# EAGLE design HS-736USB (EAGLE 7.1.0)
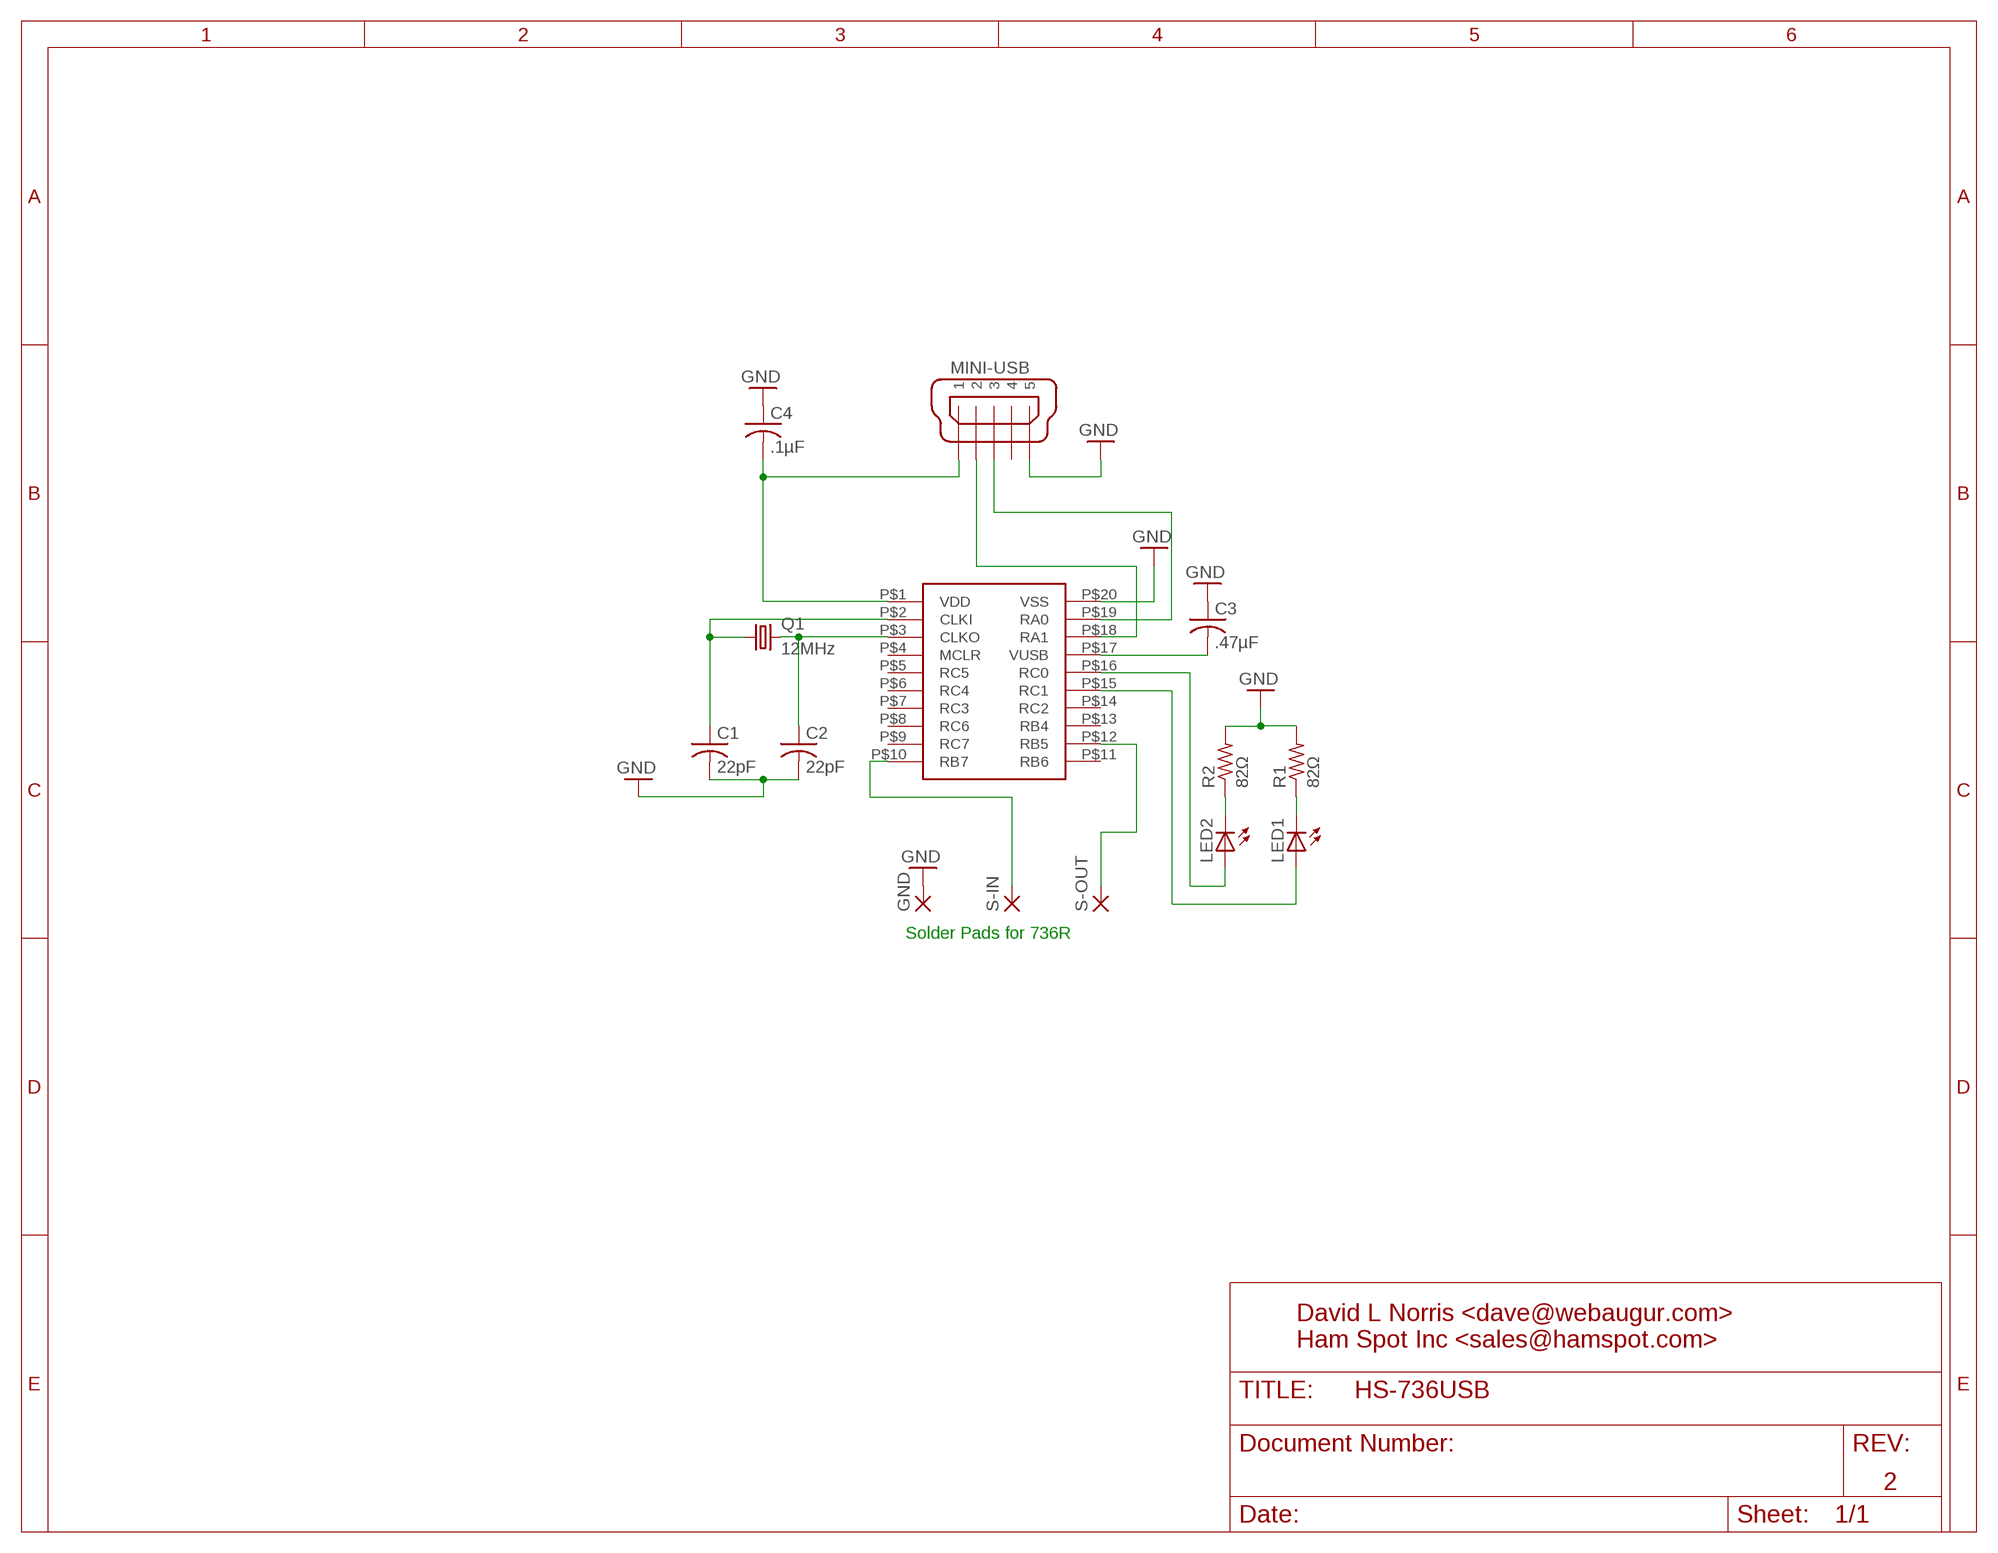
[diagram p0: schematic, sheet 1]

## Parts
C1  22pF  C-USC1206  [C1206]
C2  22pF  C-USC1206  [C1206]
C3  .47µF  C-USC1206  [C1206]
C4  .1µF  C-USC1206  [C1206]
GND  3,17/1,3  [3,17/1,3]
LED1  LED5MM  [LED5MM]
LED2  LED5MM  [LED5MM]
MINI-USB  MINI-USB-UX60-MB-5ST  [UX60-MB-5ST]
Q1  12MHz  CRYSTALHC49S  [HC49/S]
R1  82Ω  R-US_0204/2V  [0204V]
R2  82Ω  R-US_0204/2V  [0204V]
S-IN  3,17/1,3  [3,17/1,3]
S-OUT  3,17/1,3  [3,17/1,3]
U$1  14K50_DIP  [14K50_DIP]

## Nets
GND: C1.2 C2.2 C3.1 C4.1 GND.1(P) MINI-USB.5 R1.2 R2.2 U$1.P$20(VSS)
N$1: C2.1 Q1.2 U$1.P$3(CLKO)
N$2: C1.1 Q1.1 U$1.P$2(CLKI)
N$3: LED2.K(C) R2.1
N$4: C4.2 MINI-USB.1 U$1.P$1(VDD)
N$5: LED1.K(C) R1.1
N$6: C3.2 U$1.P$17(VUSB)
N$7: MINI-USB.2 U$1.P$18(RA1)
N$8: MINI-USB.3 U$1.P$19(RA0)
N$9: S-OUT.1(P) U$1.P$12(RB5)
N$10: S-IN.1(P) U$1.P$10(RB7)
N$11: LED2.A U$1.P$16(RC0)
N$12: LED1.A U$1.P$15(RC1)
Unconnected: MINI-USB.4 U$1.P$4(MCLR) U$1.P$5(RC5) U$1.P$6(RC4) U$1.P$7(RC3) U$1.P$8(RC6) U$1.P$9(RC7) U$1.P$11(RB6) U$1.P$13(RB4) U$1.P$14(RC2)

## Notes on the sheet
- Solder Pads for 736R
- David L Norris <dave@webaugur.com>
  Ham Spot Inc <sales@hamspot.com>
- 2

## Library data of the parts
C1-C4 = rcl:C-US: CAPACITOR, American symbol
GND S-IN S-OUT = wirepad:3,17/1,3: THROUGH-HOLE PAD
LED1 LED2 = led:LED: LED OSRAM: - CHIPLED LG R971, LG N971, LY N971, LG Q971, LY Q971, LO R971, LY R971 LH N974, LH R974 LS Q976, LO Q976, LY Q976 LO Q996 - Hyper CHIPLED LW Q18S LB Q993, LB Q99A, LB R99A - SideLED LS A670, LO A670, LY A670, LG A670, LP A670 LB A673, LV A673, LT A673, LW A673 LH A674 LY A675 LS A676, LA A676, LO A676, LY A676, LW A676 LS A679, LY A679, LG A679 - Hyper Micro SIDELED® LS Y876, LA Y876, LO Y876, LY Y876 LT Y87S - SmartLED LW L88C, LW L88S LB L89C, LB L89S, LG L890 LS L89K, LO L89K, LY L89K LS L896, LA L896, LO L896, LY L896 - TOPLED LS T670, LO T670, LY T670, LG T670, LP T670 LSG T670, LSP T670, LSY T670, LOP T670, LYG T670 LG T671, LOG T671, LSG T671 LB T673, LV T673, LT T673, LW T673 LH T674 LS T676, LA T676, LO T676, LY T676, LB T676, LH T676, LSB T676, LW T676 LB T67C, LV T67C, LT T67C, LS T67K, LO T67K, LY T67K, LW E67C LS E67B, LA E67B, LO E67B, LY E67B, LB E67C, LV E67C, LT E67C LW T67C LS T679, LY T679, LG T679 LS T770, LO T770, LY T770, LG T770, LP T770 LB T773, LV T773, LT T773, LW T773 LH T774 LS E675, LA E675, LY E675, LS T675 LS T776, LA T776, LO T776, LY T776, LB T776 LHGB T686 LT T68C, LB T68C - Hyper Mini TOPLED® LB M676 - Mini TOPLED Santana® LG M470 LS M47K, LO M47K, LY M47K Source: http://www.osram.convergy.de LUXEON: - LUMILED® LXK2-PW12-R00, LXK2-PW12-S00, LXK2-PW14-U00, LXK2-PW14-V00 LXK2-PM12-R00, LXK2-PM12-S00, LXK2-PM14-U00 LXK2-PE12-Q00, LXK2-PE12-R00, LXK2-PE12-S00, LXK2-PE14-T00, LXK2-PE14-U00 LXK2-PB12-K00, LXK2-PB12-L00, LXK2-PB12-M00, LXK2-PB14-N00, LXK2-PB14-P00, LXK2-PB14-Q00 LXK2-PR12-L00, LXK2-PR12-M00, LXK2-PR14-Q00, LXK2-PR14-R00 LXK2-PD12-Q00, LXK2-PD12-R00, LXK2-PD12-S00 LXK2-PH12-R00, LXK2-PH12-S00 LXK2-PL12-P00, LXK2-PL12-Q00, LXK2-PL12-R00 Source: www.luxeon.com KINGBRIGHT: KA-3528ASYC Source: www.kingbright.com
MINI-USB = con-hirose:MINI-USB-: MINI USB Connector Source: http://www.hirose.co.jp/cataloge_hp/e24000019.pdf; OC_FARNELL: unknown; OC_NEWARK: unknown
Q1 = crystal:CRYSTAL: CRYSTAL; OC_FARNELL: 1667008; OC_NEWARK: unknown
R1 R2 = rcl:R-US_: RESISTOR, American symbol
U$1 = 14K50_dip:14K50_DIP: 14K50 20pin dip

## Board
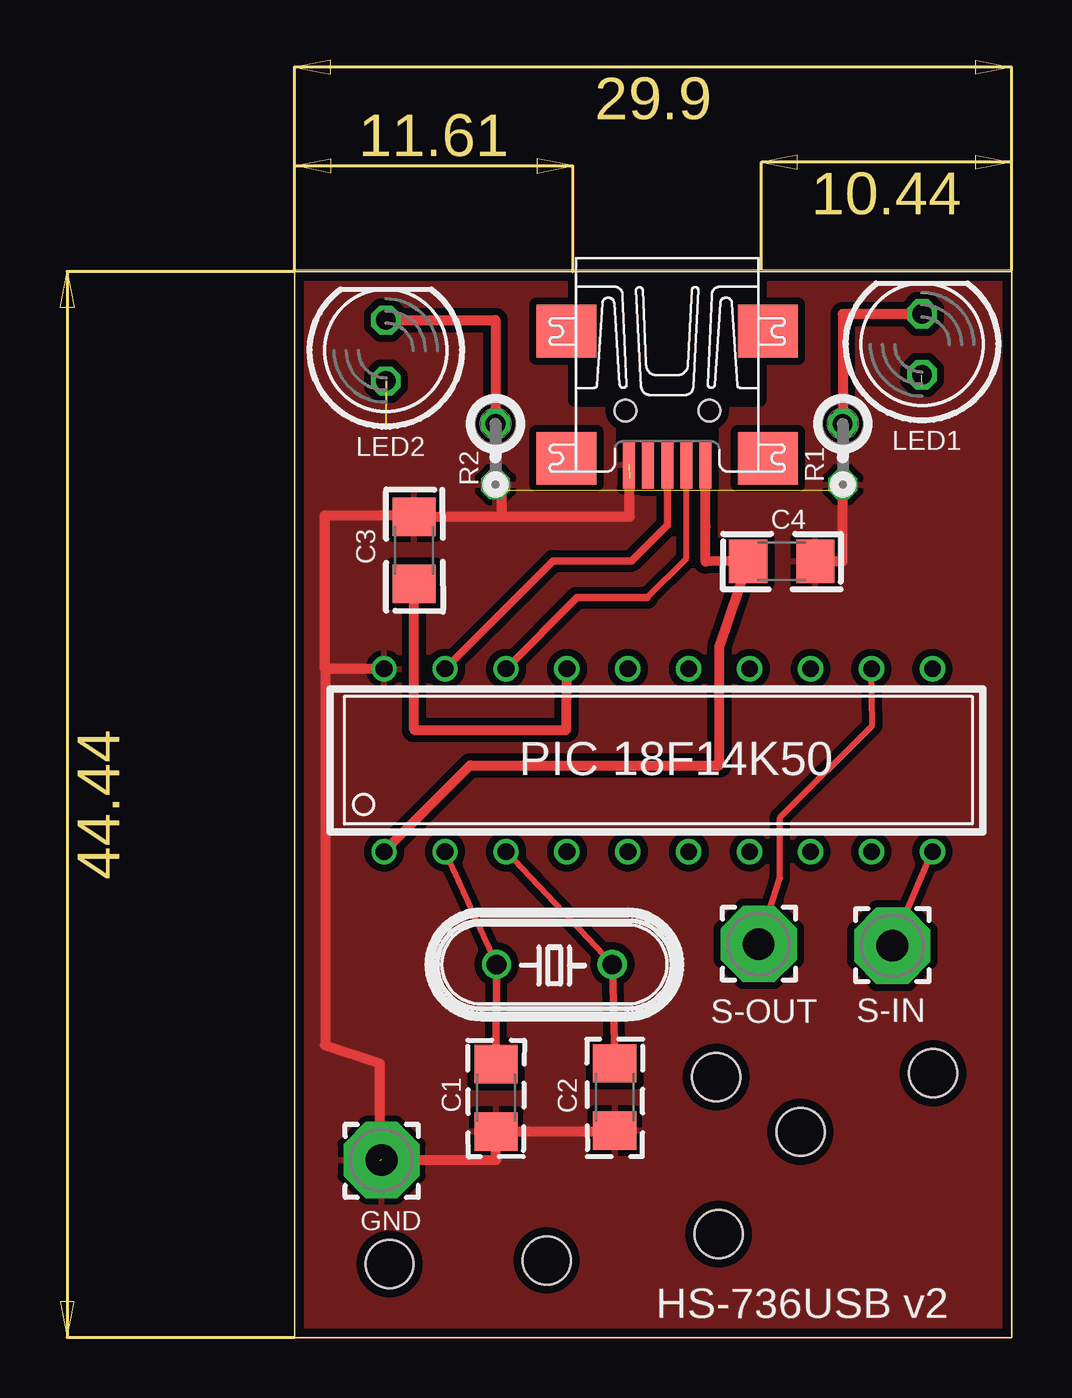
[diagram p1: board, top side]
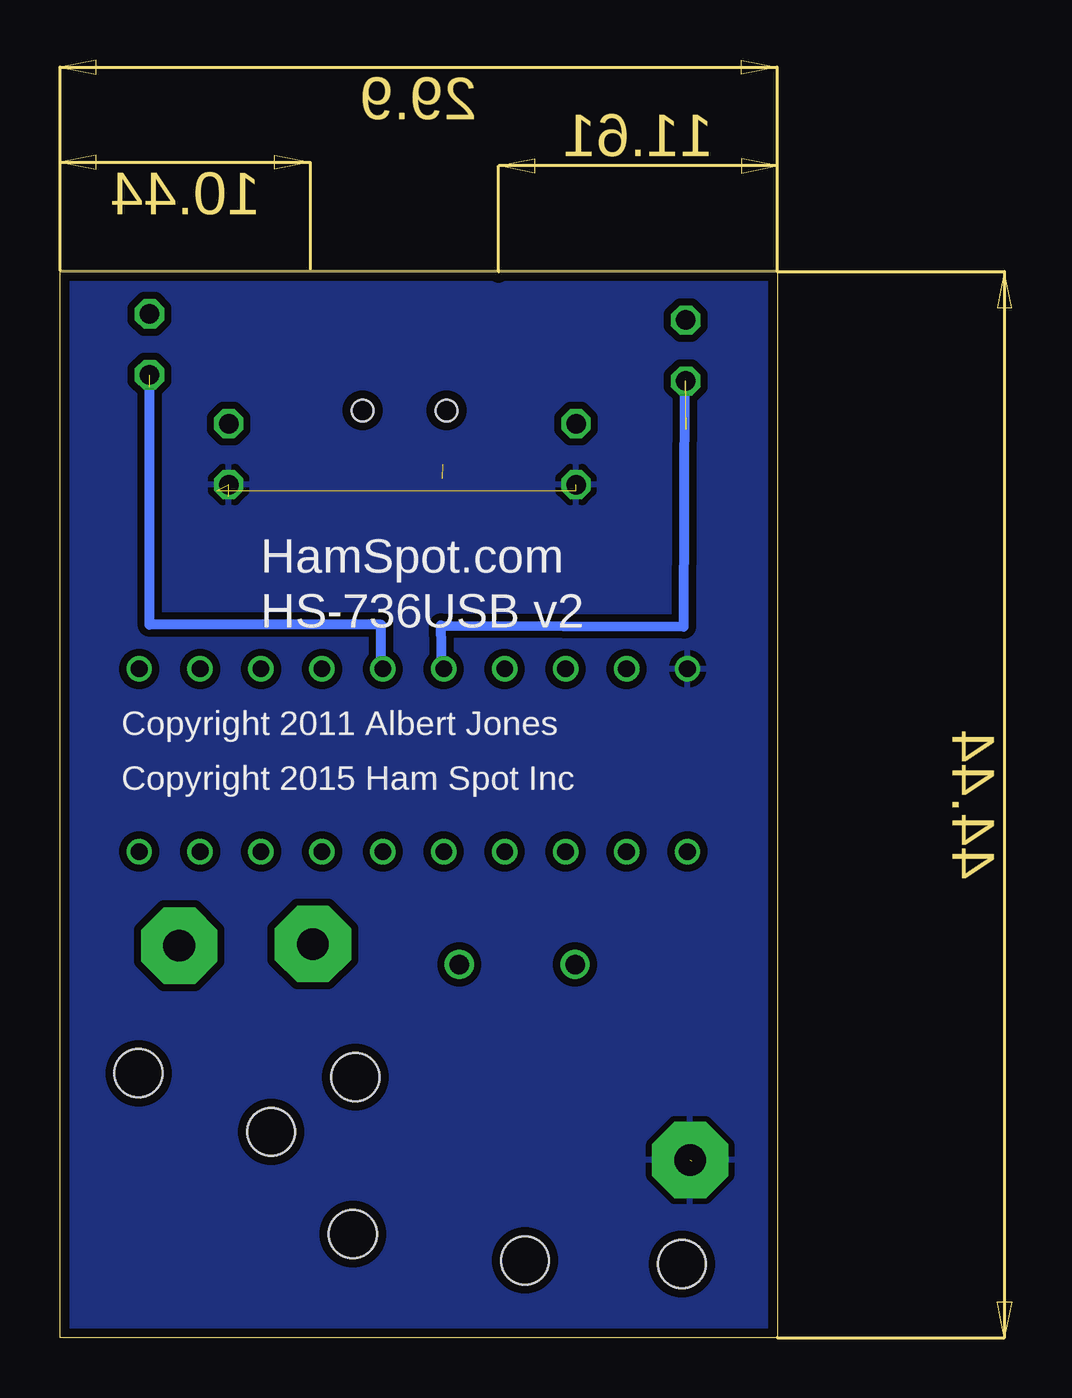
[diagram p2: board, bottom side, seen from below]

Size 29.9 x 44.49 mm. Coordinates in mm from the lower left corner, seen from the top.
Outline: 29.9,44.49 0,44.49
Outline: 0,0 29.9,0 29.9,44.44 0,44.44 0,0
Copper layers (1*16): Top 0.0356mm / dielectric 1.5011mm / Bottom 0.0356mm
Design rules "LaenPCBOrder": minimum track width 6mil, minimum drill 13mil, track to track 6mil, track to pad 6mil, pad to pad 6mil, via to via 6mil, smd to smd 6mil, copper to edge 15mil, drill to drill 6mil, minimum pad ring 7mil, minimum via ring 7mil, stop-mask expansion 3mil, vias tented up to drill 0mil, thermal gap 10mil
Holes 2 mm at 17.58,10.87 17.69,4.32 26.62,11.02 3.97,3.07 10.51,3.22 21.09,8.58

### Footprints (pad centres in the part's own frame; a part is rotated, then mirrored left to right if it is on the bottom)
C1206 = smd 1.6 x 1.8: 1 -1.4,0; 2 1.4,0
3,17/1,3 = drill 1.321 pad 3.175 octagon: 1 0,0
LED5MM = drill 0.813 octagon: A -1.27,0; K 1.27,0
UX60-MB-5ST = smd 2 x 0.5: 1 2.25,1.6; 2 2.25,0.8; 3 2.25,0; 4 2.25,-0.8; 5 2.25,-1.6 | smd 2.2 x 2.5: M1 -3.3,-4.2; M2 -3.3,4.2; M3 2,4.2; M4 2,-4.2 | hole 0.9: 0,-1.75; 0,1.75
HC49/S = drill 0.813: 1 -2.413,0; 2 2.413,0
0204V = drill 0.813 octagon: 1 -1.27,0; 2 1.27,0
14K50_DIP = drill 0.7: P$1 -1.524,24.511; P$2 -1.524,21.971; P$3 -1.524,19.431; P$4 -1.524,16.891; P$5 -1.524,14.351; P$6 -1.524,11.811; P$7 -1.524,9.271; P$8 -1.524,6.731; P$9 -1.524,4.191; P$10 -1.524,1.651; P$11 6.096,1.651; P$12 6.096,4.191; P$13 6.096,6.731; P$14 6.096,9.271; P$15 6.096,11.811; P$16 6.096,14.351; P$17 6.096,16.891; P$18 6.096,19.431; P$19 6.096,21.971; P$20 6.096,24.511

### Placement (x,y rotation side)
C1  8.41,10 270 top
C2  13.35,10.04 270 top
C3  4.99,32.82 270 top
C4  20.31,32.37 180 top
GND  3.63,7.4 0 top
LED1  26.16,41.4 90 top
LED2  3.81,41.15 90 top
MINI-USB  15.54,38.65 270 top
Q1  10.84,15.56 0 top
R1  22.86,36.83 270 top
R2  8.38,36.83 270 top
S-IN  24.93,16.35 0 top
S-OUT  19.36,16.41 0 top
U$1  28.25,21.79 90 top

### Tracks (layer width: path | path; a pad name or v marks a point on that pad's centre or on a via)
GND  (6 unrouted)
  Top 0.406: 8.64,34.22 C3.1 4.99,34.29 1.27,34.29 1.27,27.88 | 8.64,34.22 13.97,34.22 13.97,35.81 | R2.2 8.64,35.56 8.64,34.22 | U$1.P$20 1.27,27.88 | 1.27,27.88 1.27,12.19 3.56,11.43 3.56,7.37 | GND.1 8.41,7.41 C1.2 13.35,8.6 C2.2 | C4.1 22.86,32.37 22.86,35.05
  pour Top (isolate 0.305): 0,44.45 29.9,44.45 29.9,0 0,0
  pour Bottom (isolate 0.305): 0,44.45 29.9,44.45 29.9,0 0,0
N$1
  Top 0.254: Q1.2 U$1.P$3
  Top 0.305: C2.1 Q1.2
N$2
  Top 0.254: Q1.1 U$1.P$2
  Top 0.305: C1.1 Q1.1
N$3
  Top 0.406: LED2.K 8.38,42.42 R2.1
N$4
  Top 0.406: MINI-USB.1 17.14,33.8 17.14,32.35 C4.2 17.71,28.81 17.71,23.85 7.33,23.85 U$1.P$1
N$5
  Top 0.406: LED1.K 22.86,42.67 R1.1
N$6
  Top 0.406: C3.2 4.99,25.33 11.33,25.33 U$1.P$17
N$7
  Top 0.254: 14.7,30.84 16.34,32.49 MINI-USB.2
  Top 0.305: 14.7,30.84 11.78,30.84 U$1.P$18
N$8
  Top 0.305: U$1.P$19 10.78,32.38 14.05,32.38 15.54,33.88 MINI-USB.3
N$9
  Top 0.254: S-OUT.1 20.25,19.16 20.25,21.68 24.09,25.52 U$1.P$12
N$10
  Top 0.254: S-IN.1 U$1.P$10
N$11  (2 unrouted)
  Bottom 0.406: U$1.P$16 13.97,27.88 14.02,29.69 3.89,29.64 3.83,39.9
N$12  (1 unrouted)
  Bottom 0.406: U$1.P$15 16.51,27.88 16.51,29.72 26.16,29.72 26.16,39.62

### Text on the board
_tsilk: HS-736USB v2
_bsilk: HamSpot.com | HS-736USB v2 | Copyright 2011 Albert Jones | Copyright 2015 Ham Spot Inc